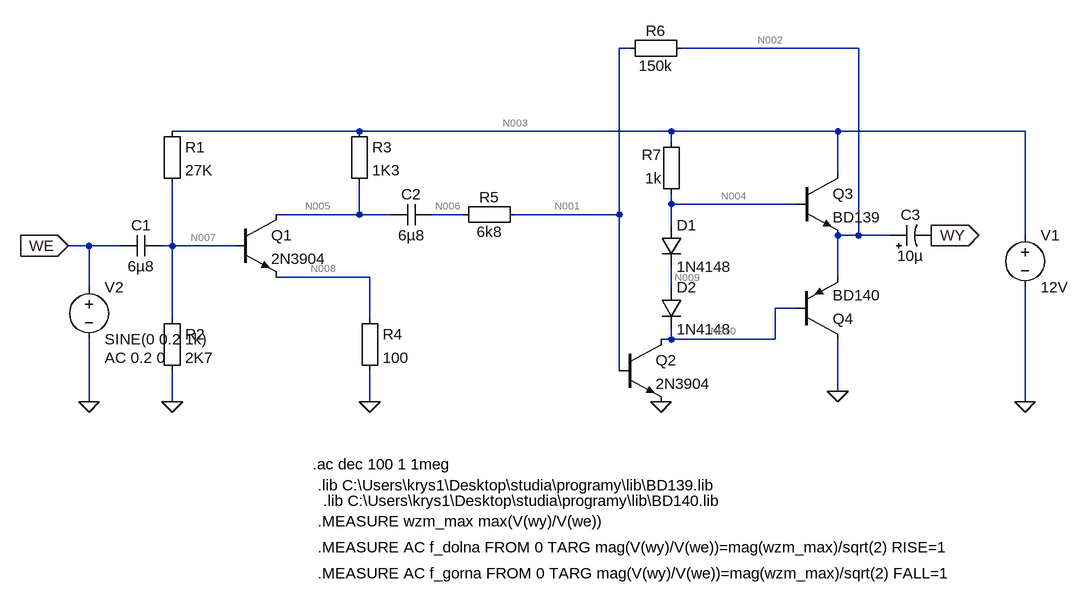
[diagram p0: schematic v5.asc]
v5.asc, the LTspice schematic file:
Version 4.1
SHEET 1 1560 728
WIRE 880 -96 864 -96
WIRE 1232 -96 960 -96
WIRE 464 32 176 32
WIRE 944 32 464 32
WIRE 1200 32 944 32
WIRE 1488 32 1200 32
WIRE 944 48 944 32
WIRE 1200 96 1200 32
WIRE 944 144 944 128
WIRE 1136 144 944 144
WIRE 464 160 464 112
WIRE 464 160 336 160
WIRE 512 160 464 160
WIRE 624 160 576 160
WIRE 864 160 864 -96
WIRE 864 160 704 160
WIRE 944 176 944 144
WIRE 1232 192 1232 -96
WIRE 1232 192 1200 192
WIRE 1280 192 1232 192
WIRE 1488 192 1488 32
WIRE 48 208 16 208
WIRE 96 208 48 208
WIRE 176 208 176 112
WIRE 176 208 160 208
WIRE 272 208 176 208
WIRE 480 256 336 256
WIRE 1200 256 1200 192
WIRE 48 272 48 208
WIRE 944 272 944 240
WIRE 1136 304 1104 304
WIRE 176 320 176 208
WIRE 480 320 480 256
WIRE 944 352 944 336
WIRE 944 352 928 352
WIRE 1104 352 1104 304
WIRE 1104 352 944 352
WIRE 864 400 864 160
WIRE 1200 432 1200 352
WIRE 48 448 48 352
WIRE 176 448 176 400
WIRE 480 448 480 400
WIRE 1488 448 1488 272
FLAG 176 448 0
FLAG 480 448 0
FLAG 1488 448 0
FLAG 16 208 WE
IOPIN 16 208 In
FLAG 48 448 0
FLAG 1344 192 WY
IOPIN 1344 192 Out
FLAG 1200 432 0
FLAG 928 448 0
DATAFLAG 224 208 "$-V(N002)"
DATAFLAG 480 160 "$-V(N002)"
SYMBOL npn 272 160 R0
SYMATTR InstName Q1
SYMATTR Value 2N3904
SYMBOL Misc\\EuropeanResistor 160 16 R0
SYMATTR InstName R1
SYMATTR Value 27K
SYMBOL Misc\\EuropeanResistor 160 304 R0
SYMATTR InstName R2
SYMATTR Value 2K7
SYMBOL Misc\\EuropeanResistor 448 16 R0
SYMATTR InstName R3
SYMATTR Value 1K3
SYMBOL Misc\\EuropeanResistor 464 304 R0
SYMATTR InstName R4
SYMATTR Value 100
SYMBOL voltage 1488 176 R0
WINDOW 123 0 0 Left 0
WINDOW 39 0 0 Left 0
SYMATTR InstName V1
SYMATTR Value 12V
SYMBOL Misc\\EuropeanResistor 720 144 R90
WINDOW 0 5 56 VBottom 2
WINDOW 3 27 56 VTop 2
SYMATTR InstName R5
SYMATTR Value 6k8
SYMBOL diode 928 176 R0
SYMATTR InstName D1
SYMATTR Value 1N4148
SYMBOL voltage 48 256 R0
WINDOW 123 24 124 Left 2
WINDOW 39 0 0 Left 0
SYMATTR Value2 AC 0.2 0
SYMATTR InstName V2
SYMATTR Value SINE(0 0.2 1k)
SYMBOL cap 160 192 R90
WINDOW 0 0 32 VBottom 2
WINDOW 3 32 32 VTop 2
SYMATTR InstName C1
SYMATTR Value 6µ8
SYMBOL cap 576 144 R90
WINDOW 0 0 32 VBottom 2
WINDOW 3 32 32 VTop 2
SYMATTR InstName C2
SYMATTR Value 6µ8
SYMBOL Misc\\EuropeanResistor 976 -112 R90
WINDOW 0 5 56 VBottom 2
WINDOW 3 27 56 VTop 2
SYMATTR InstName R6
SYMATTR Value 150k
SYMBOL Misc\\EuropeanResistor 960 144 R180
WINDOW 0 31 76 Left 2
WINDOW 3 31 40 Left 2
SYMATTR InstName R7
SYMATTR Value 1k
SYMBOL diode 928 272 R0
SYMATTR InstName D2
SYMATTR Value 1N4148
SYMBOL npn 864 352 R0
SYMATTR InstName Q2
SYMATTR Value 2N3904
SYMBOL npn 1136 96 R0
SYMATTR InstName Q3
SYMATTR Value BD139
SYMBOL pnp 1136 352 M180
SYMATTR InstName Q4
SYMATTR Value BD140
SYMBOL polcap 1280 208 R270
WINDOW 0 32 32 VTop 2
WINDOW 3 0 32 VBottom 2
SYMATTR InstName C3
SYMATTR Value 10µ
TEXT 392 544 Left 2 !.ac dec 100 1 1meg
TEXT 400 632 Left 2 !.MEASURE wzm_max max(V(wy)/V(we))
TEXT 400 672 Left 2 !.MEASURE AC f_dolna FROM 0 TARG mag(V(wy)/V(we))=mag(wzm_max)/sqrt(2) RISE=1
TEXT 400 576 Left 2 !.lib C:\\Users\\krys1\\Desktop\\studia\\programy\\lib\\BD139.lib
TEXT 408 600 Left 2 !.lib C:\\Users\\krys1\\Desktop\\studia\\programy\\lib\\BD140.lib
TEXT 400 712 Left 2 !.MEASURE AC f_gorna FROM 0 TARG mag(V(wy)/V(we))=mag(wzm_max)/sqrt(2) FALL=1

The netlist it stands for:
* v5.asc
Q1 N005 N007 N008 0 2N3904
R1 N003 N007 27K
R2 N007 0 2K7
R3 N003 N005 1K3
R4 N008 0 100
V1 N003 0 12V
R5 N001 N006 6k8
D1 N004 N009 1N4148
V2 WE 0 SINE(0 0.2 1k) AC 0.2 0
C1 N007 WE 6µ8
C2 N006 N005 6µ8
R6 N002 N001 150k
R7 N004 N003 1k
D2 N009 N010 1N4148
Q2 N010 N001 0 0 2N3904
Q3 N003 N004 N002 0 BD139
Q4 0 N010 N002 0 BD140
C3 N002 WY 10µ
.model D D
.lib standard.dio
.model NPN NPN
.model PNP PNP
.lib standard.bjt
.ac dec 100 1 1meg
.MEASURE wzm_max max(V(wy)/V(we))
.MEASURE AC f_dolna FROM 0 TARG mag(V(wy)/V(we))=mag(wzm_max)/sqrt(2) RISE=1
.lib C:\Users\krys1\Desktop\studia\programy\lib\BD139.lib
.lib C:\Users\krys1\Desktop\studia\programy\lib\BD140.lib
.MEASURE AC f_gorna FROM 0 TARG mag(V(wy)/V(we))=mag(wzm_max)/sqrt(2) FALL=1
.backanno
.end

* Results of the author's LTspice run, read from the files saved beside the schematic
* Operating Point, zero values left out:
*   V(n001) = 703.4 mV
*   V(n002) = 3.813 V
*   V(n003) = 12 V
*   V(n004) = 4.407 V
*   V(n005) = 7.16 V
*   V(n006) = 703.4 mV
*   V(n007) = 1.062 V
*   V(n008) = 373.5 mV
*   V(n009) = 3.792 V
*   V(n010) = 3.176 V
*   V(wy) = 3.813 V
*   I(D1) = 1.935 mA
*   I(D2) = 1.935 mA
*   I(R1) = 405.1 µA
*   I(R2) = 393.3 µA
*   I(R3) = 3.723 mA
*   I(R4) = 3.735 mA
*   I(R6) = 20.73 µA
*   I(R7) = -7.593 mA
*   I(V1) = -421.7 mA
*   Ib(Q1) = 11.8 µA
*   Ib(Q2) = 20.73 µA
*   Ib(Q3) = 5.659 mA
*   Ib(Q4) = -4.343 mA
*   Ic(Q1) = 3.723 mA
*   Ic(Q2) = 6.277 mA
*   Ic(Q3) = 410 mA
*   Ic(Q4) = -411.3 mA
*   Ie(Q1) = -3.735 mA
*   Ie(Q2) = -6.298 mA
*   Ie(Q3) = -415.7 mA
*   Ie(Q4) = 415.6 mA
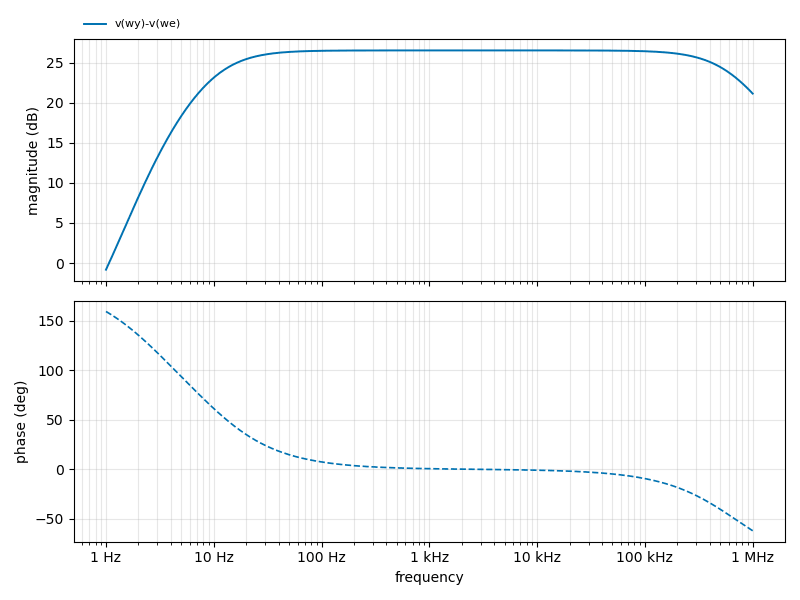
[diagram p1: AC Analysis of v5.asc, plotted from the saved traces]
* AC Analysis, 1 run:
*   v(wy)-v(we): -0.83 dB at 1 Hz, 21.15 dB at 1 MHz, peak 26.53 dB at 2.63 kHz, 3 dB below the peak at 10.85 Hz and 638.8 kHz
* From the log:
*   wzm_max: MAX(V(wy)/V(we))=(40.5915362212dB,0.036301703767°) FROM 1 TO 1000000
*   f_dolna=10.9016316553 FROM 0 TO 10.9016316553
*   f_gorna=638238.034972 FROM 0 TO 638238.034972